# Altium project CW308T_CEC1702.PrjPcb
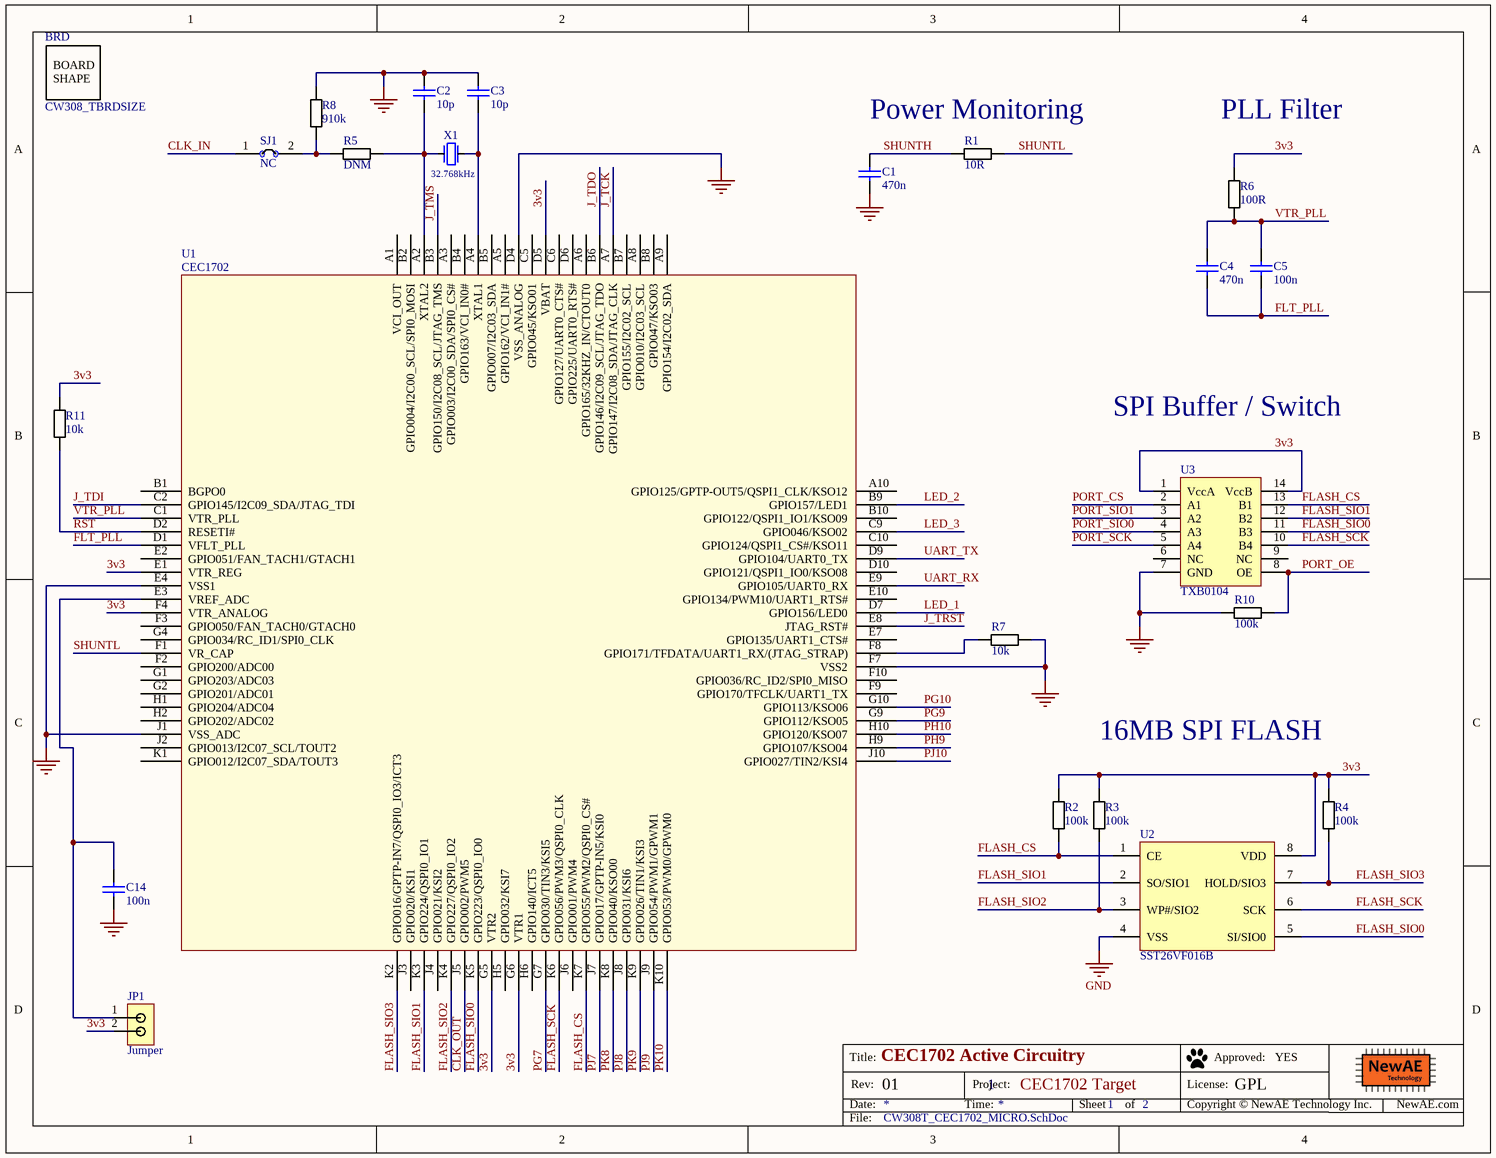
[diagram p0: CW308T_CEC1702_MICRO.SchDoc]
PrjLicense: GPL; PrjName: CEC1702 Target; PrjRev: 01
2 sheets, 35 parts. Net scope: global (net labels, ports and power ports of the same name join across sheets).
Board files: CW308T_CEC1702.PcbDoc, CW308T_CEC1702_PANEL.PcbDoc
Sheets:
  CW308T_CEC1702_MICRO.SchDoc
  CW308T_CEC1702_UFO.SchDoc

## Sheet CW308T_CEC1702_MICRO.SchDoc: CEC1702 Active Circuitry
size Letter; Organization: NewAE Technology Inc.; Address1: 1083 Queen St., Suite 196; Address2: Halifax; Address3: NS; Address4: Canada B3H 0B2; DocumentNumber: 1; SheetNumber: 1; SheetTotal: 2; SheetApproved: YES

### Parts
BRD  CW308_TBRDSIZE  [CW308T_TBOARD_DEFSIZE]
C1  470n  [CAPC0603_M]
C2  10p  [CAPC0603_M]
C3  10p  [CAPC0603_M]
C4  470n  [CAPC0603_M]
C5  100n  [CAPC0603_M]
C14  100n  [CAPC0603_M]
JP1  Jumper  [2x2.54mm_Header]
R1  10R  [RESC1608X55N]
R2  100k  [RESC1608X55N]
R3  100k  [RESC1608X55N]
R4  100k  [RESC1608X55N]
R5  DNM  [RESC1608X55N]
R6  100R  [RESC1608X55N]
R7  10k  [RESC1608X55N]
R8  910k  [RESC1608X55N]
R10  100k  [RESC1608X55N]
R11  10k  [RESC1608X55N]
SJ1  NC  [SJ_2S_NC]  (no BOM)
U1  CEC1702  [84L_WFBGA]
U2  SST26VF016B  [SOIC8_NARROW]
U3  TXB0104  [SOIC14 (R-PDSO-G14)]
X1  32.768kHz  [FC-135]

### Nets
3v3: JP1.2 R2.1 R3.1 R4.1 R6.1 R11.1 U1.D5(VBAT) U1.E1(VTR_REG) U1.F4(VTR_ANALOG) U1.G5(VTR2) U1.G6(VTR1) U2.8(VDD) U3.1(VccA) U3.14(VccB)
GND: C1.1 C2.1 C3.1 C14.2 R7.2 R8.1 R10.1 U1.D4(VSS_ANALOG) U1.E4(VSS1) U1.F7(VSS2) U1.J1(VSS_ADC) U2.4(VSS) U3.7(GND)
CLK_IN: SJ1.1
CLK_OUT: U1.J5(GPIO002/PWM5)
FLASH_CS: R2.2 U1.K7(GPIO055/PWM2/QSPI0_CS#) U2.1(CE) U3.13(B1)
FLASH_SCK: U1.K6(GPIO056/PWM3/QSPI0_CLK) U2.6(SCK) U3.10(B4)
FLASH_SIO0: U1.K5(GPIO223/QSPI0_IO0) U2.5(SI/SIO0) U3.11(B3)
FLASH_SIO1: U1.K3(GPIO224/QSPI0_IO1) U2.2(SO/SIO1) U3.12(B2)
FLASH_SIO2: R3.2 U1.K4(GPIO227/QSPI0_IO2) U2.3(WP#/SIO2)
FLASH_SIO3: R4.2 U1.K2(GPIO016/GPTP-IN7/QSPI0_IO3/ICT3) U2.7(HOLD/SIO3)
FLT_PLL: C4.2 C5.2 U1.D1(VFLT_PLL)
J_TCK: U1.A7(GPIO147/I2C08_SDA/JTAG_CLK)
J_TDI: U1.C2(GPIO145/I2C09_SDA/JTAG_TDI)
J_TDO: U1.B6(GPIO146/I2C09_SCL/JTAG_TDO)
J_TMS: U1.B3(GPIO150/I2C08_SCL/JTAG_TMS)
J_TRST: U1.E8(JTAG_RST#)
LED_1: U1.D7(GPIO156/LED0)
LED_2: U1.B9(GPIO157/LED1)
LED_3: U1.C9(GPIO046/KSO02)
PG7: U1.G7(GPIO030/TIN3/KSI5)
PG9: U1.G9(GPIO112/KSO05)
PG10: U1.G10(GPIO113/KSO06)
PH9: U1.H9(GPIO107/KSO04)
PH10: U1.H10(GPIO120/KSO07)
PJ7: U1.J7(GPIO017/GPTP-IN5/KSI0)
PJ8: U1.J8(GPIO031/KSI6)
PJ9: U1.J9(GPIO054/PWM1/GPWM1)
PJ10: U1.J10(GPIO027/TIN2/KSI4)
PK8: U1.K8(GPIO040/KSO00)
PK9: U1.K9(GPIO026/TIN1/KSI3)
PK10: U1.K10(GPIO053/PWM0/GPWM0)
PORT_CS: U3.2(A1)
PORT_OE: R10.2 U3.8(OE)
PORT_SCK: U3.5(A4)
PORT_SIO0: U3.4(A3)
PORT_SIO1: U3.3(A2)
RST: R11.2 U1.D2(RESETI#)
SHUNTH: C1.2 R1.1
SHUNTL: R1.2 U1.F1(VR_CAP)
UART_RX: U1.E9(GPIO105/UART0_RX)
UART_TX: U1.D9(GPIO104/UART0_TX)
VTR_PLL: C4.1 C5.1 R6.2 U1.C1(VTR_PLL)
NetC2_2: C2.2 R5.2 U1.A2(XTAL2) X1.1
NetC3_2: C3.2 U1.A4(XTAL1) X1.2
NetC14_1: C14.1 JP1.1 U1.E3(VREF_ADC)
NetR5_1: R5.1 R8.2 SJ1.2
NetR7_1: R7.1 U1.F8(GPIO171/TFDATA/UART1_RX/(JTAG_STRAP))

Not connected (* = marked no-connect by the designer): U1 A1(VCI_OUT) A3(GPIO003/I2C00_SDA/SPI0_CS#) A5(GPIO162/VCI_IN1#) A6(GPIO165/32KHZ_IN/CTOUT0) A8(GPIO010/I2C03_SCL) A9(GPIO154/I2C02_SDA) A10(GPIO125/GPTP-OUT5/QSPI1_CLK/KSO12) B1(BGPO0) B2(GPIO004/I2C00_SCL/SPI0_MOSI) B4(GPIO163/VCI_IN0#) B5(GPIO007/I2C03_SDA) B7(GPIO155/I2C02_SCL) B8(GPIO047/KSO03) B10(GPIO122/QSPI1_IO1/KSO09) C5(GPIO045/KSO01) C6(GPIO127/UART0_CTS#) C10(GPIO124/QSPI1_CS#/KSO11) D6(GPIO225/UART0_RTS#) D10(GPIO121/QSPI1_IO0/KSO08) E2(GPIO051/FAN_TACH1/GTACH1) E7(GPIO135/UART1_CTS#) E10(GPIO134/PWM10/UART1_RTS#) F2(GPIO200/ADC00) F3(GPIO050/FAN_TACH0/GTACH0) F9(GPIO170/TFCLK/UART1_TX) F10(GPIO036/RC_ID2/SPI0_MISO) G1(GPIO203/ADC03) G2(GPIO201/ADC01) G4(GPIO034/RC_ID1/SPI0_CLK) H1(GPIO204/ADC04) H2(GPIO202/ADC02) H5(GPIO032/KSI7) H6(GPIO140/ICT5) J2(GPIO013/I2C07_SCL/TOUT2) J3(GPIO020/KSI1) J4(GPIO021/KSI2) J6(GPIO001/PWM4) K1(GPIO012/I2C07_SDA/TOUT3); U3 6(NC) 9(NC)

### Notes on the sheet
- Power Monitoring
- PLL Filter
- SPI Buffer / Switch
- 16MB SPI FLASH
- Title:
- Date:
- Rev:
- Time:
- Project:
- Sheet
- of
- License:
- Copyright © NewAE Technology Inc.
- Approved:
- NewAE.com
- File:
- (in symbol CW308T_BRDSHAPE_DEFAULT) BOARD / SHAPE

### Library data of the parts
BRD = CW308T_BRDSHAPE_DEFAULT: 308T Board Outline (Layer 1); Component Group: Mechanical; Part Number: CW308T_BRDSHAPE_DEFAULT; Component Kind: Mechanical; Component Type: Mechanical
C1 = CCHIP-470n-0603-50V: 470n, 0603, 50V; Manufacture Part Number 1: UMK107B7474KA-TR; Manufacture 1: Taiyo Yuden; Component Group: Capacitor; Case-EIA: 0603; Rated Voltage: 50VDC; Part Number: CCHIP-470n-0603-50V; Footprint: 0603; Pin Count: 2; Supplier 1: Digi-Key; Supplier Part Number 1: 587-3170-1-ND; Value: 470n; Mounting Technology: SMT; Component Kind: Standard; Component Type: Standard; RoHS: Yes; Temperature Range: -55C to 125C
C2 C3 = CCHIP-10p-0603: 10p, 0603; Component Group: Capacitor; Case-EIA: 0603; Case-Metric: 1608; Part Number: CCHIP-10p-0603; Footprint: 0603; Pin Count: 2; Value: 10p; Mounting Technology: SMT; Component Kind: Standard; Component Type: Standard
C4 = CCHIP-470n-0603-50V: 470n, 0603, 50V; Manufacture 1: Taiyo Yuden; Manufacture Part Number 1: UMK107B7474KA-TR; Component Group: Capacitor; Case-EIA: 0603; Part Number: CCHIP-470n-0603-50V; Footprint: 0603; Pin Count: 2; Supplier 1: Digi-Key; Supplier Part Number 1: 587-3170-1-ND; Value: 470n; Rated Voltage: 50V; Mounting Technology: SMT; RoHS: Yes; Temperature Range: -55C to 125C; Component Kind: Standard; Component Type: Standard
C5 C14 = CCHIP-100n-0603: 100n, 0603; Manufacture 1: Kemet; Manufacture Part Number 1: C0603C104K5RACTU; Component Group: Capacitor; Case-EIA: 0603; Case-Metric: 1608; Rated Voltage: 50V; Part Number: CCHIP-100n-0603; Footprint: 0603; Pin Count: 2; Supplier 1: Digi-Key; Supplier Part Number 1: 399-5089-2-ND; Value: 100n; Mounting Technology: SMT; Component Kind: Standard; Component Type: Standard
JP1 = 2_PIN_JUMPER: 1x2 2.54mm header, male pins; Manufacture 1: Harwin; Manufacture Part Number 1: M20-9990246; Component Group: PCB Feature; PP Material Stack: 0; Part Number: 2_PIN_JUMPER; Pin Count: 2; Supplier 1: Digi-Key; Supplier Part Number 1: 952-2262-ND; Mounting Technology: Through-hole; RoHS: Yes; Component Kind: Standard; Component Type: Standard; PP Rotation: 0
R1 = RCHIP-10R-0603: 10R res, 0603, 1%, 1/10W; Manufacture 1: Yageo; Manufacture Part Number 1: RC0603FR-0710RL; Component Group: Resistor; Case-EIA: 0603; Case-Metric: 1608; Rated Power: 0.1W; Rated Voltage: 75VDC; Part Number: RCHIP-10R-0603; Footprint: 0603; Pin Count: 2; Supplier 1: Digi-Key; Supplier Part Number 1: 311-10.0HRCT-ND; Value: 10R; Tolerance: 1%; Mounting Technology: SMT; Temperature Range: -55C to 155C; Component Kind: Standard; Component Type: Standard
R2-R4 R10 = RCHIP-100K-0603: 100k res, 0603, 1%, 1/10W; Manufacture 1: Yageo; Manufacture Part Number 1: RC0603FR-07100KL; Component Group: Resistor; Case-EIA: 0603; Case-Metric: 1608; Rated Power: 0.1W; Rated Voltage: 75VDC; Part Number: RCHIP-100K-0603; Footprint: 0603; Pin Count: 2; Supplier 1: Digi-Key; Supplier Part Number 1: 311-100KHRCT-ND; Value: 100k; Tolerance: 1%; Mounting Technology: SMT; Temperature Range: -55C to 155C; Component Kind: Standard; Component Type: Standard
R5 R6 = RCHIP-100R-0603: 100R res, 0603, 1%, 1/10W; Manufacture 1: Yageo; Manufacture Part Number 1: RC0603FR-07100RL; Component Group: Resistor; Case-EIA: 0603; Case-Metric: 1608; Rated Power: 0.1W; Rated Voltage: 75VDC; Part Number: RCHIP-100R-0603; Footprint: 0603; Pin Count: 2; Supplier 1: Digi-Key; Supplier Part Number 1: 311-100HRCT-ND; Value: 100R; Tolerance: 1%; Mounting Technology: SMT; Temperature Range: -55C to 155C; Component Kind: Standard; Component Type: Standard
R7 R11 = RCHIP-10K-0603: 10k res, 0603, 1%, 1/10W; Manufacture 1: Yageo; Manufacture Part Number 1: RC0603FR-0710KL; Component Group: Resistor; Case-EIA: 0603; Case-Metric: 1608; Rated Power: 0.1W; Rated Voltage: 75VDC; Part Number: RCHIP-10K-0603; Footprint: 0603; Pin Count: 2; Supplier 1: Digi-Key; Supplier Part Number 1: 311-10.0KHRCT-ND; Value: 10k; Tolerance: 1%; Mounting Technology: SMT; Temperature Range: -55C to 155C; Component Kind: Standard; Component Type: Standard
R8 = RCHIP-910K-0603: 910k res, 0603, 1%, 1/10W; Manufacture 1: Yageo; Manufacture Part Number 1: RC0603FR-07910KL; Component Group: Resistor; Case-EIA: 0603; Case-Metric: 1608; Rated Power: 0.1W; Rated Voltage: 75VDC; Part Number: RCHIP-910K-0603; Footprint: 0603; Pin Count: 2; Supplier 1: Digi-Key; Supplier Part Number 1: 311-910KHRCT-ND; Value: 910k; Tolerance: 1%; Mounting Technology: SMT; Temperature Range: -55C to 155C; Component Kind: Standard; Component Type: Standard
SJ1 = SJ_2S: Solder Jumper, NC; Component Group: PCB Feature; Part Number: SJ_2S; Pin Count: 2; Mounting Technology: COPPER; Component Type: Standard (No BOM)
U1 = CEC1702: CEC1702, 84WFBGA, microchip hardware crypto; Manufacture Part Number 1: CEC1702Q-B1-SX-TR; Component Group: Digital IC; PP Material Stack: 0; Part Number: CEC1702; Manufacture 1: Microchip; Pin Count: 84; Supplier 1: Digi-Key; Supplier Part Number 1: CEC1702Q-B1-SX-CT-ND; ComponentLink1Description: Datasheet; ComponentLink1URL: http://ww1.microchip.com/downloads/en/DeviceDoc/00002207B.pdf; Mounting Technology: SMT; RoHS: Yes; Component Kind: Standard; Component Type: Standard; PP Rotation: 0
U2 = SST26VF016B: IC FLASH 16MBIT 104MHZ 8SOIC; Manufacture 1: Microchip; Manufacture Part Number 1: SST26VF016B-104I/SN; Component Group: Digital IC; PP Material Stack: 0; Part Number: SST26VF016B; Footprint: SOIC8; Pin Count: 8; Supplier 1: Digi-Key; Supplier Part Number 1: SST26VF016B-104I/SN-ND; Mounting Technology: SMT; Component Kind: Standard; Component Type: Standard; PP Rotation: 0
U3 = TXB0104DR: IC 4BIT NON-INV TRANSLTR 14-SOIC; Manufacture 1: Texas Instruments; Component Group: Digital IC; PP Material Stack: 0; Part Number: TXB0104DR; Manufacture Part Number 1: TXB0104DR; Pin Count: 14; Supplier 1: Digi-Key; Supplier Part Number 1: 296-21928-1-ND; Mounting Technology: SMT; RoHS: Yes; Component Kind: Standard; Component Type: Standard; PP Rotation: 0
X1 = FC-135: Crystal, 32kHz, 32.768kHz, 2-pin; Manufacture 1: EPSON; Manufacture Part Number 1: FC-135 32.7680KA-K0; PP Material Stack: 0; Part Number: FC-135; Component Group: Crystal; Pin Count: 2; Supplier 1: Digi-Key; Supplier Part Number 1: SER4087CT-ND; Mounting Technology: SMT; Component Kind: Standard; Component Type: Standard; PP Rotation: 0

## Sheet CW308T_CEC1702_UFO.SchDoc: CEC1702 Target Pin Connections
size Letter; Organization: NewAE Technology Inc.; Address1: 1083 Queen St., Suite 196; Address2: Halifax; Address3: NS; Address4: Canada B3H 0B2; DocumentNumber: 2; SheetNumber: 2; SheetTotal: 2; SheetApproved: YES
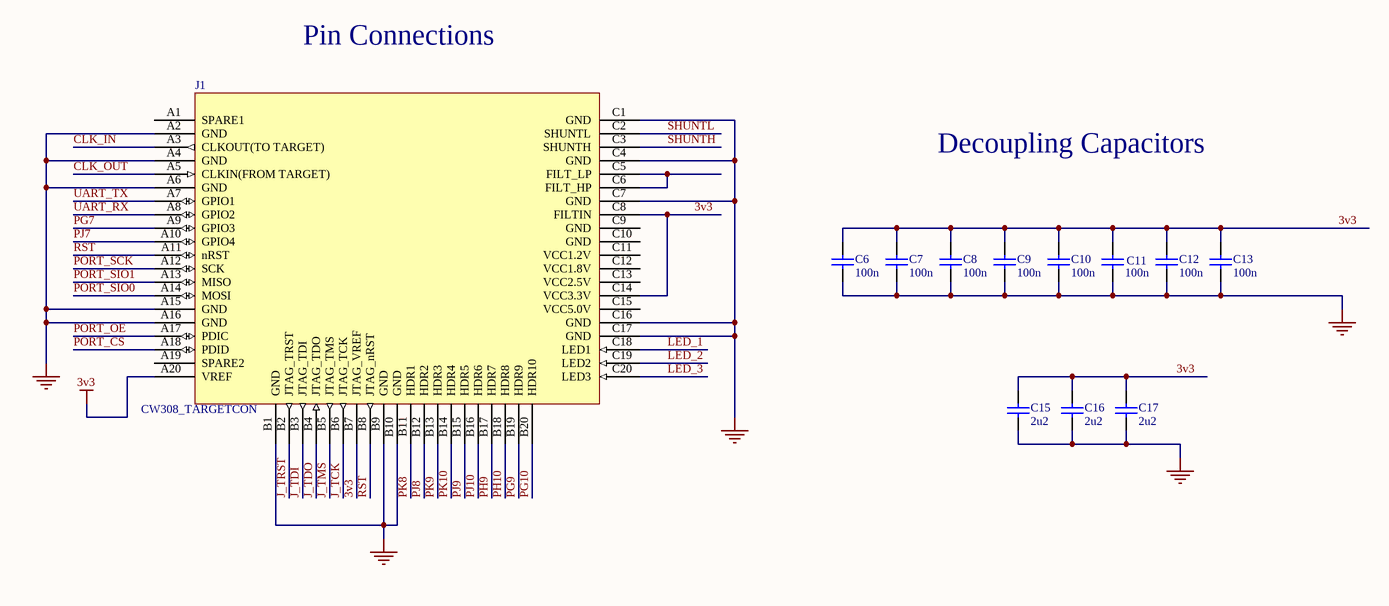
[diagram p1: CW308T_CEC1702_UFO.SchDoc]

### Parts
C6  100n  [CAPC0603_M]
C7  100n  [CAPC0603_M]
C8  100n  [CAPC0603_M]
C9  100n  [CAPC0603_M]
C10  100n  [CAPC0603_M]
C11  100n  [CAPC0603_M]
C12  100n  [CAPC0603_M]
C13  100n  [CAPC0603_M]
C15  2u2  [CAPC0603_M]
C16  2u2  [CAPC0603_M]
C17  2u2  [CAPC0603_M]
J1  CW308_TARGETCON  [CW308_TBOARD_CONN]

### Nets
3v3: C6.1 C7.1 C8.1 C9.1 C10.1 C11.1 C12.1 C13.1 C15.1 C16.1 C17.1 J1.A20(VREF) J1.B7(JTAG_VREF) J1.C8(FILTIN) J1.C14(VCC3.3V)
GND: C6.2 C7.2 C8.2 C9.2 C10.2 C11.2 C12.2 C13.2 C15.2 C16.2 C17.2 J1.A2(GND) J1.A4(GND) J1.A6(GND) J1.A15(GND) J1.A16(GND) J1.B1(GND) J1.B9(GND) J1.B10(GND) J1.C1(GND) J1.C4(GND) J1.C7(GND) J1.C16(GND) J1.C17(GND)
CLK_IN: J1.A3(CLKOUT(TO_TARGET))
CLK_OUT: J1.A5(CLKIN(FROM_TARGET))
J_TCK: J1.B6(JTAG_TCK)
J_TDI: J1.B3(JTAG_TDI)
J_TDO: J1.B4(JTAG_TDO)
J_TMS: J1.B5(JTAG_TMS)
J_TRST: J1.B2(JTAG_TRST)
LED_1: J1.C18(LED1)
LED_2: J1.C19(LED2)
LED_3: J1.C20(LED3)
PG7: J1.A9(GPIO3)
PG9: J1.B19(HDR9)
PG10: J1.B20(HDR10)
PH9: J1.B17(HDR7)
PH10: J1.B18(HDR8)
PJ7: J1.A10(GPIO4)
PJ8: J1.B12(HDR2)
PJ9: J1.B15(HDR5)
PJ10: J1.B16(HDR6)
PK8: J1.B11(HDR1)
PK9: J1.B13(HDR3)
PK10: J1.B14(HDR4)
PORT_CS: J1.A18(PDID)
PORT_OE: J1.A17(PDIC)
PORT_SCK: J1.A12(SCK)
PORT_SIO0: J1.A14(MOSI)
PORT_SIO1: J1.A13(MISO)
RST: J1.A11(nRST) J1.B8(JTAG_nRST)
SHUNTH: J1.C3(SHUNTH)
SHUNTL: J1.C2(SHUNTL)
UART_RX: J1.A8(GPIO2)
UART_TX: J1.A7(GPIO1)
NetJ1_C5: J1.C5(FILT_LP) J1.C6(FILT_HP)

Not connected (* = marked no-connect by the designer): J1 A1(SPARE1) A19(SPARE2) C9(GND) C10(GND) C11(VCC1.2V) C12(VCC1.8V) C13(VCC2.5V) C15(VCC5.0V)

### Notes on the sheet
- Pin Connections
- Decoupling Capacitors
- Title:
- Date:
- Rev:
- Time:
- Project:
- Sheet
- of
- License:
- Copyright © NewAE Technology Inc.
- Approved:
- NewAE.com
- File:

### Library data of the parts
C6-C13 = CCHIP-100n-0603: as C5 on sheet CW308T_CEC1702_MICRO; Part Number: CCHIP-100n-0603; Footprint: 0603; Pin Count: 2; Supplier 1: Digi-Key; Supplier Part Number 1: 399-5089-2-ND; Value: 100n; Mounting Technology: SMT; Component Kind: Standard; Component Type: Standard
C15-C17 = CCHIP-2u2-0603: 2u2, 0603; Manufacture 1: Samsung; Manufacture Part Number 1: CL10B225KP8NNNC; Component Group: Capacitor; Case-EIA: 0603; Case-Metric: 1608; Part Number: CCHIP-2u2-0603; Footprint: 0603; Pin Count: 2; Supplier 1: Digi-Key; Supplier Part Number 1: 1276-1134-2-ND; Value: 2u2; Mounting Technology: SMT; Component Kind: Standard; Component Type: Standard
J1 = CW308_TBOARD: CW308 "Standard" Target Board Connector; Component Group: Mechanical; Pitch: 2.54mm; Part Number: CW308_TBOARD; Pin Count: 60; Mounting Technology: Through-hole; Component Kind: Standard; Component Type: Standard

## Nets that join several sheets
3v3: CW308T_CEC1702_MICRO (14 pins), CW308T_CEC1702_UFO (15 pins)
GND: CW308T_CEC1702_MICRO (13 pins), CW308T_CEC1702_UFO (24 pins)
CLK_IN: CW308T_CEC1702_MICRO (SJ1.1), CW308T_CEC1702_UFO (J1.A3)
CLK_OUT: CW308T_CEC1702_MICRO (U1.J5), CW308T_CEC1702_UFO (J1.A5)
J_TCK: CW308T_CEC1702_MICRO (U1.A7), CW308T_CEC1702_UFO (J1.B6)
J_TDI: CW308T_CEC1702_MICRO (U1.C2), CW308T_CEC1702_UFO (J1.B3)
J_TDO: CW308T_CEC1702_MICRO (U1.B6), CW308T_CEC1702_UFO (J1.B4)
J_TMS: CW308T_CEC1702_MICRO (U1.B3), CW308T_CEC1702_UFO (J1.B5)
J_TRST: CW308T_CEC1702_MICRO (U1.E8), CW308T_CEC1702_UFO (J1.B2)
LED_1: CW308T_CEC1702_MICRO (U1.D7), CW308T_CEC1702_UFO (J1.C18)
LED_2: CW308T_CEC1702_MICRO (U1.B9), CW308T_CEC1702_UFO (J1.C19)
LED_3: CW308T_CEC1702_MICRO (U1.C9), CW308T_CEC1702_UFO (J1.C20)
PG7: CW308T_CEC1702_MICRO (U1.G7), CW308T_CEC1702_UFO (J1.A9)
PG9: CW308T_CEC1702_MICRO (U1.G9), CW308T_CEC1702_UFO (J1.B19)
PG10: CW308T_CEC1702_MICRO (U1.G10), CW308T_CEC1702_UFO (J1.B20)
PH9: CW308T_CEC1702_MICRO (U1.H9), CW308T_CEC1702_UFO (J1.B17)
PH10: CW308T_CEC1702_MICRO (U1.H10), CW308T_CEC1702_UFO (J1.B18)
PJ7: CW308T_CEC1702_MICRO (U1.J7), CW308T_CEC1702_UFO (J1.A10)
PJ8: CW308T_CEC1702_MICRO (U1.J8), CW308T_CEC1702_UFO (J1.B12)
PJ9: CW308T_CEC1702_MICRO (U1.J9), CW308T_CEC1702_UFO (J1.B15)
PJ10: CW308T_CEC1702_MICRO (U1.J10), CW308T_CEC1702_UFO (J1.B16)
PK8: CW308T_CEC1702_MICRO (U1.K8), CW308T_CEC1702_UFO (J1.B11)
PK9: CW308T_CEC1702_MICRO (U1.K9), CW308T_CEC1702_UFO (J1.B13)
PK10: CW308T_CEC1702_MICRO (U1.K10), CW308T_CEC1702_UFO (J1.B14)
PORT_CS: CW308T_CEC1702_MICRO (U3.2), CW308T_CEC1702_UFO (J1.A18)
PORT_OE: CW308T_CEC1702_MICRO (R10.2 U3.8), CW308T_CEC1702_UFO (J1.A17)
PORT_SCK: CW308T_CEC1702_MICRO (U3.5), CW308T_CEC1702_UFO (J1.A12)
PORT_SIO0: CW308T_CEC1702_MICRO (U3.4), CW308T_CEC1702_UFO (J1.A14)
PORT_SIO1: CW308T_CEC1702_MICRO (U3.3), CW308T_CEC1702_UFO (J1.A13)
RST: CW308T_CEC1702_MICRO (R11.2 U1.D2), CW308T_CEC1702_UFO (J1.A11 J1.B8)
SHUNTH: CW308T_CEC1702_MICRO (C1.2 R1.1), CW308T_CEC1702_UFO (J1.C3)
SHUNTL: CW308T_CEC1702_MICRO (R1.2 U1.F1), CW308T_CEC1702_UFO (J1.C2)
UART_RX: CW308T_CEC1702_MICRO (U1.E9), CW308T_CEC1702_UFO (J1.A8)
UART_TX: CW308T_CEC1702_MICRO (U1.D9), CW308T_CEC1702_UFO (J1.A7)

## Assembly variants
Production of CW308T_CEC1702: not fitted R5 X1